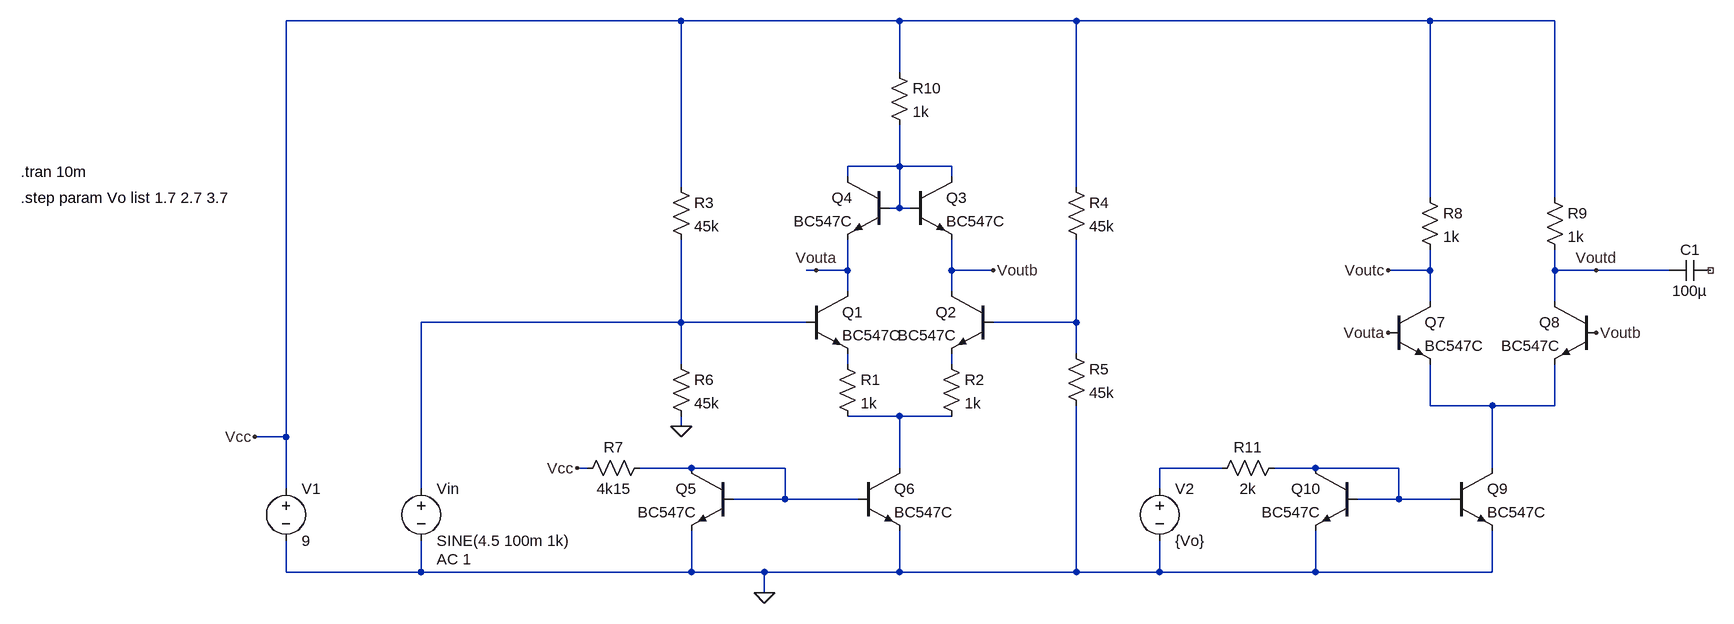
[diagram p0: schematic steilheitsmultiplizierer.asc]
steilheitsmultiplizierer.asc, the LTspice schematic file:
Version 4
SHEET 1 1416 680
WIRE -176 -256 -784 -256
WIRE 160 -256 -176 -256
WIRE 432 -256 160 -256
WIRE 976 -256 432 -256
WIRE 1168 -256 976 -256
WIRE 160 -176 160 -256
WIRE 160 -32 160 -96
WIRE 160 -32 80 -32
WIRE 240 -32 160 -32
WIRE 80 -16 80 -32
WIRE 240 -16 240 -32
WIRE -176 0 -176 -256
WIRE 432 0 432 -256
WIRE 976 16 976 -256
WIRE 1168 16 1168 -256
WIRE 160 32 160 -32
WIRE 160 32 144 32
WIRE 176 32 160 32
WIRE 32 128 16 128
WIRE 80 128 80 80
WIRE 80 128 32 128
WIRE 240 128 240 80
WIRE 304 128 240 128
WIRE 976 128 976 96
WIRE 976 128 912 128
WIRE 1168 128 1168 96
WIRE 1232 128 1168 128
WIRE 1344 128 1232 128
WIRE 80 160 80 128
WIRE 240 160 240 128
WIRE 976 176 976 128
WIRE 1168 176 1168 128
WIRE -176 208 -176 80
WIRE -176 208 -576 208
WIRE 16 208 -176 208
WIRE 432 208 432 80
WIRE 432 208 304 208
WIRE 432 256 432 208
WIRE -176 272 -176 208
WIRE 80 272 80 256
WIRE 240 272 240 256
WIRE 976 336 976 272
WIRE 1072 336 976 336
WIRE 1168 336 1168 272
WIRE 1168 336 1072 336
WIRE 160 352 80 352
WIRE 240 352 160 352
WIRE -176 368 -176 352
WIRE -784 384 -784 -256
WIRE -784 384 -832 384
WIRE -320 432 -336 432
WIRE -160 432 -240 432
WIRE -16 432 -160 432
WIRE 160 432 160 352
WIRE 656 432 560 432
WIRE 800 432 736 432
WIRE 928 432 800 432
WIRE 1072 432 1072 336
WIRE -784 464 -784 384
WIRE -576 464 -576 208
WIRE 560 464 560 432
WIRE -16 480 -16 432
WIRE -16 480 -96 480
WIRE 96 480 -16 480
WIRE 928 480 928 432
WIRE 928 480 864 480
WIRE 1008 480 928 480
WIRE -784 592 -784 544
WIRE -576 592 -576 544
WIRE -576 592 -784 592
WIRE -160 592 -160 528
WIRE -160 592 -576 592
WIRE -48 592 -160 592
WIRE 160 592 160 528
WIRE 160 592 -48 592
WIRE 432 592 432 336
WIRE 432 592 160 592
WIRE 560 592 560 544
WIRE 560 592 432 592
WIRE 800 592 800 528
WIRE 800 592 560 592
WIRE 1072 592 1072 528
WIRE 1072 592 800 592
WIRE -48 624 -48 592
FLAG -176 368 0
FLAG -48 624 0
FLAG -832 384 Vcc
FLAG -336 432 Vcc
FLAG 32 128 Vouta
FLAG 304 128 Voutb
FLAG 912 224 Vouta
FLAG 1232 224 Voutb
FLAG 912 128 Voutc
FLAG 1232 128 Voutd
SYMBOL npn 16 160 R0
SYMATTR InstName Q1
SYMATTR Value BC547C
SYMBOL npn 304 160 M0
SYMATTR InstName Q2
SYMATTR Value BC547C
SYMBOL res 64 256 R0
SYMATTR InstName R1
SYMATTR Value 1k
SYMBOL res 224 256 R0
SYMATTR InstName R2
SYMATTR Value 1k
SYMBOL npn 176 -16 R0
SYMATTR InstName Q3
SYMATTR Value BC547C
SYMBOL npn 144 -16 M0
SYMATTR InstName Q4
SYMATTR Value BC547C
SYMBOL npn -96 432 M0
SYMATTR InstName Q5
SYMATTR Value BC547C
SYMBOL npn 96 432 R0
SYMATTR InstName Q6
SYMATTR Value BC547C
SYMBOL res -192 -16 R0
SYMATTR InstName R3
SYMATTR Value 45k
SYMBOL res 416 -16 R0
SYMATTR InstName R4
SYMATTR Value 45k
SYMBOL res 416 240 R0
SYMATTR InstName R5
SYMATTR Value 45k
SYMBOL res -192 256 R0
SYMATTR InstName R6
SYMATTR Value 45k
SYMBOL res -224 416 R90
WINDOW 0 0 56 VBottom 2
WINDOW 3 32 56 VTop 2
SYMATTR InstName R7
SYMATTR Value 4k15
SYMBOL voltage -784 448 R0
WINDOW 123 0 0 Left 2
WINDOW 39 0 0 Left 2
SYMATTR InstName V1
SYMATTR Value 9
SYMBOL voltage -576 448 R0
WINDOW 123 24 124 Left 2
WINDOW 39 0 0 Left 2
SYMATTR Value2 AC 1
SYMATTR InstName Vin
SYMATTR Value SINE(4.5 100m 1k)
SYMBOL npn 912 176 R0
SYMATTR InstName Q7
SYMATTR Value BC547C
SYMBOL npn 1232 176 M0
SYMATTR InstName Q8
SYMATTR Value BC547C
SYMBOL npn 1008 432 R0
SYMATTR InstName Q9
SYMATTR Value BC547C
SYMBOL res 960 0 R0
SYMATTR InstName R8
SYMATTR Value 1k
SYMBOL res 1152 0 R0
SYMATTR InstName R9
SYMATTR Value 1k
SYMBOL res 144 -192 R0
SYMATTR InstName R10
SYMATTR Value 1k
SYMBOL npn 864 432 M0
SYMATTR InstName Q10
SYMATTR Value BC547C
SYMBOL res 752 416 R90
WINDOW 0 0 56 VBottom 2
WINDOW 3 32 56 VTop 2
SYMATTR InstName R11
SYMATTR Value 2k
SYMBOL voltage 560 448 R0
WINDOW 123 0 0 Left 2
WINDOW 39 0 0 Left 2
SYMATTR InstName V2
SYMATTR Value {Vo}
SYMBOL cap 1408 112 R90
WINDOW 0 0 32 VBottom 2
WINDOW 3 32 32 VTop 2
SYMATTR InstName C1
SYMATTR Value 100µ
TEXT -1192 -24 Left 2 !.tran 10m
TEXT -1192 16 Left 2 !.step param Vo list 1.7 2.7 3.7

The netlist it stands for:
* steilheitsmultiplizierer.asc
Q1 Vouta N002 N004 0 BC547C
Q2 Voutb N003 N005 0 BC547C
R1 N004 N007 1k
R2 N005 N007 1k
Q3 N001 N001 Voutb 0 BC547C
Q4 N001 N001 Vouta 0 BC547C
Q5 N008 N008 0 0 BC547C
Q6 N007 N008 0 0 BC547C
R3 Vcc N002 45k
R4 Vcc N003 45k
R5 N003 0 45k
R6 N002 0 45k
R7 N008 Vcc 4k15
V1 Vcc 0 9
Vin N002 0 SINE(4.5 100m 1k) AC 1
Q7 Voutc Vouta N006 0 BC547C
Q8 Voutd Voutb N006 0 BC547C
Q9 N006 N010 0 0 BC547C
R8 Vcc Voutc 1k
R9 Vcc Voutd 1k
R10 Vcc N001 1k
Q10 N010 N010 0 0 BC547C
R11 N010 N009 2k
V2 N009 0 {Vo}
C1 NC_01 Voutd 100µ
.model NPN NPN
.model PNP PNP
.lib standard.bjt
.tran 10m
.step param Vo list 1.7 2.7 3.7
.backanno
.end